# Altium schematic sheet Peripheral Interface.SchDoc
size A3; Date: 2026/04/16; ApprovedBy: NA; Author: 邱上峯; CompanyName: JFM常裕富士機工; Engineer: 邱上峯; Revision: V1.0; SheetNumber: 3; SheetTotal: 8; Pcb Name: NA
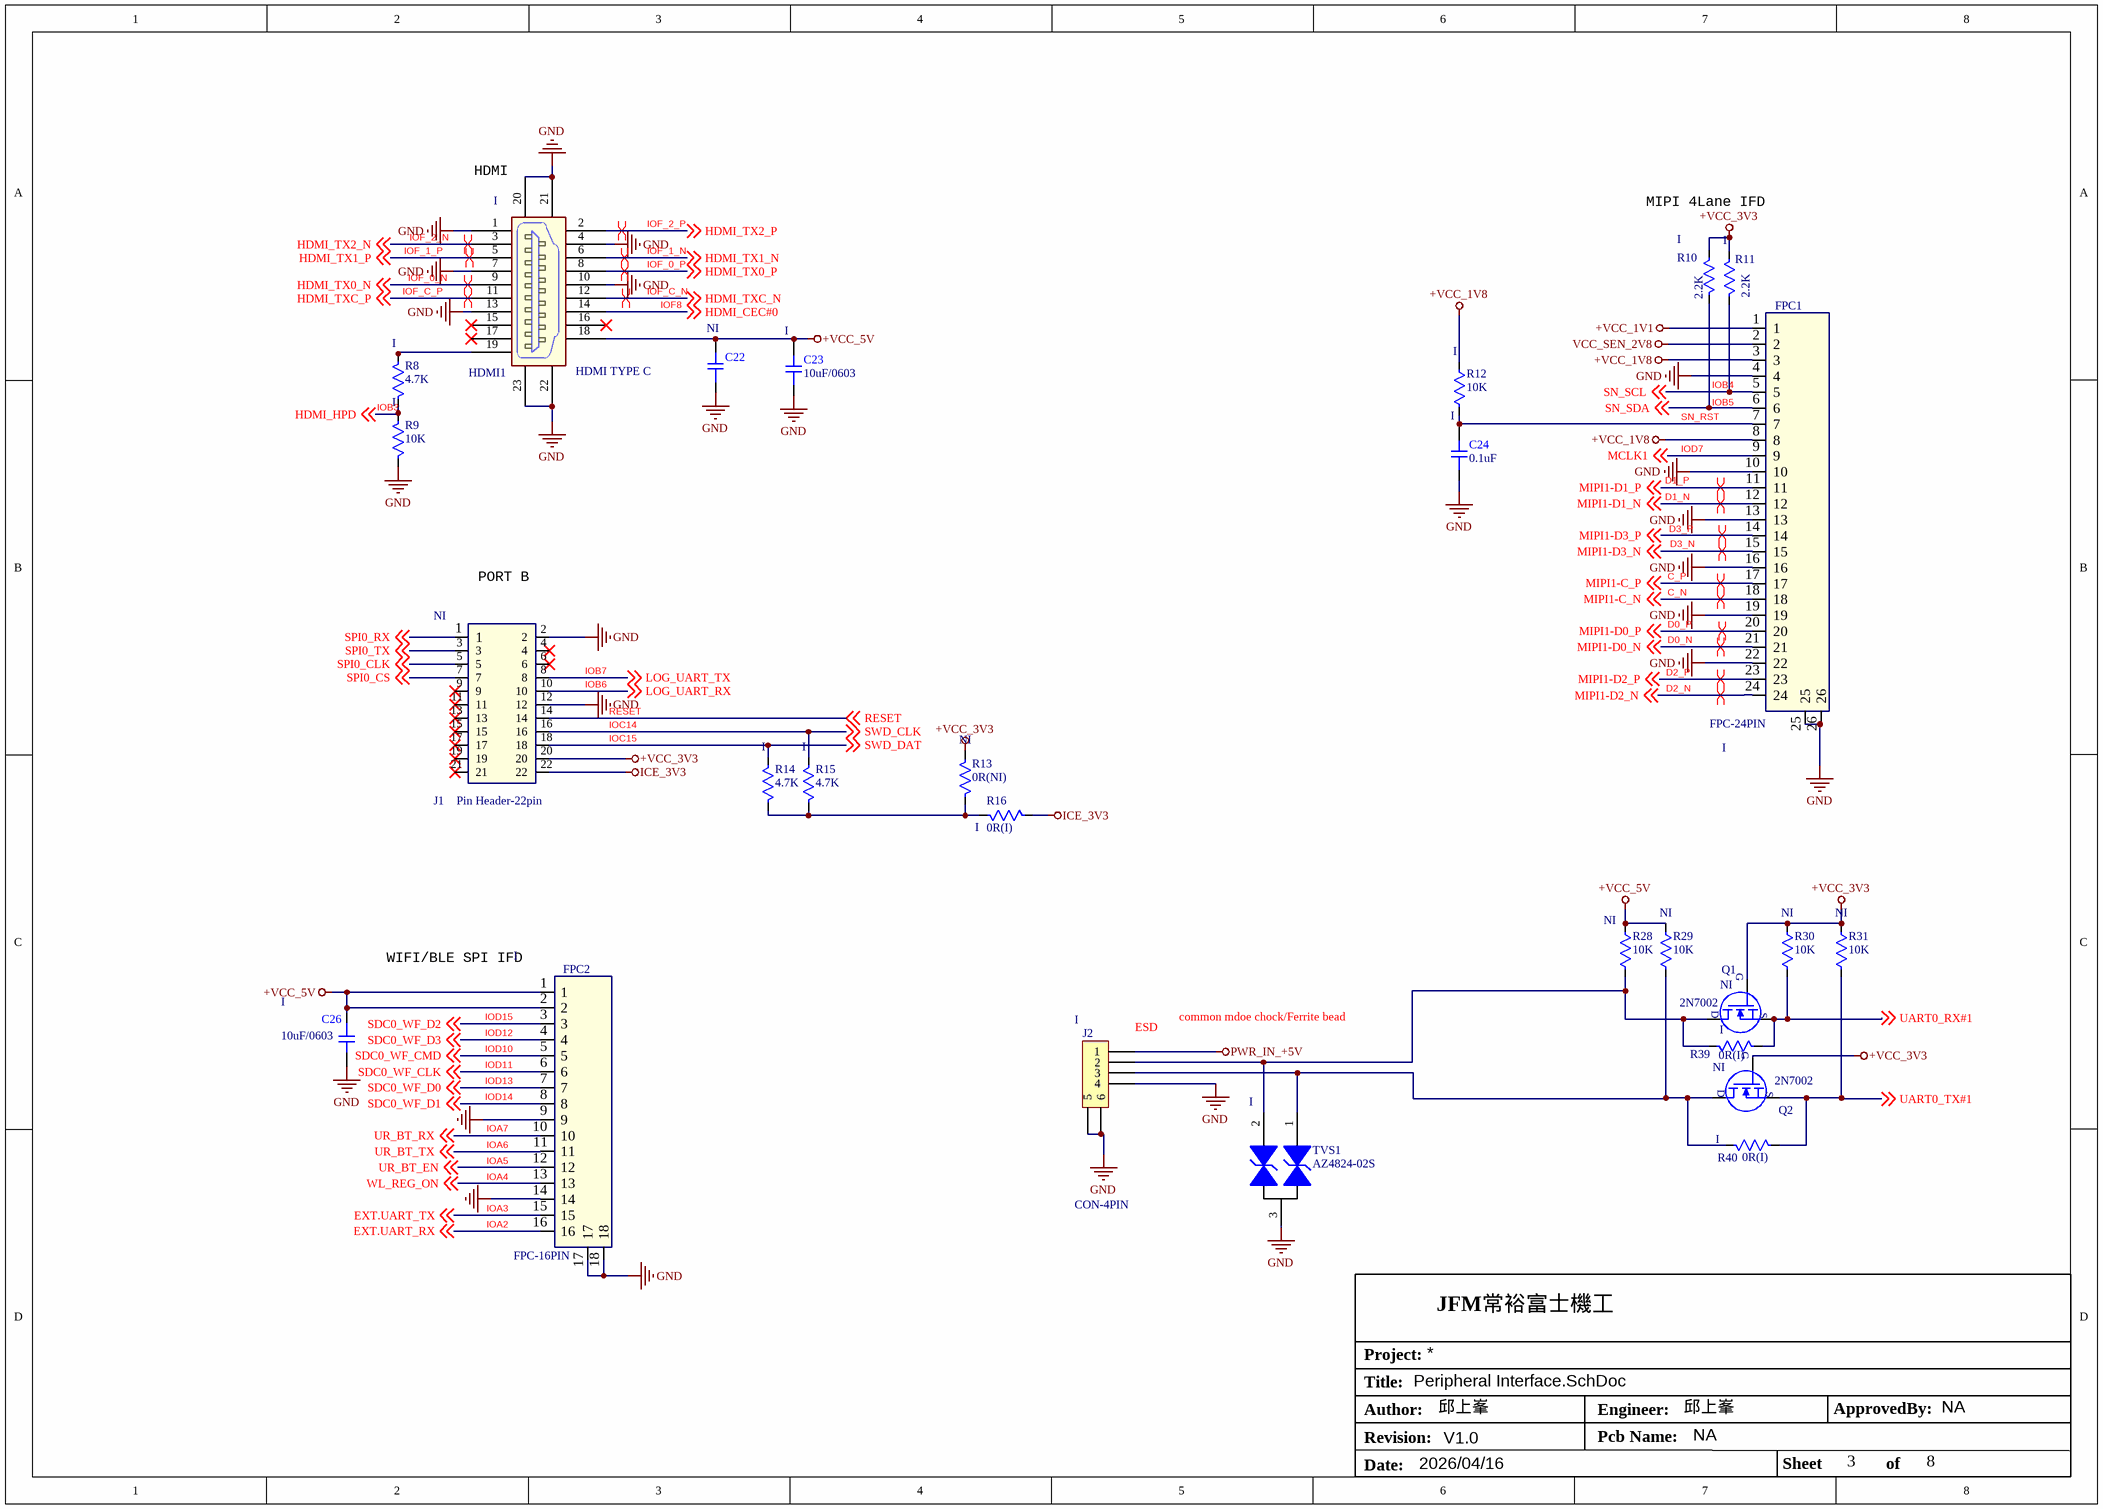
[diagram p0: Peripheral Interface.SchDoc]

## Parts
C22  NI  [C0402]
C23  10uF/0603  BOM: I  [C0603]
C24  0.1uF  BOM: I  [C0402]
C26  10uF/0603  BOM: I  [C0603]
FPC1  FPC-24PIN  BOM: I  [FPC-0.5 pitch 24PIN]
FPC2  FPC-16PIN  BOM: I  [FPC-0.5 pitch 16PIN]
HDMI1  HDMI TYPE C  BOM: I  [HDMI TYPE C]
J1  Pin Header-22pin  BOM: NI  [1.27mm Pin Header Through Hole-22P]
J2  CON-4PIN  BOM: I  [P20M2I-04SMT]
Q1  2N7002  BOM: NI  [SMD-SOT-23]
Q2  2N7002  BOM: NI  [SMD-SOT-23]
R8  4.7K  BOM: I  [R0402]
R9  10K  BOM: I  [R0402]
R10  2.2K  BOM: I  [R0603]
R11  2.2K  BOM: I  [R0603]
R12  10K  BOM: I  [R0402]
R13  0R(NI)  BOM: NI  [R0402]
R14  4.7K  BOM: I  [R0402]
R15  4.7K  BOM: I  [R0402]
R16  0R(I)  BOM: I  [R0402]
R28  10K  BOM: NI  [R0402]
R29  10K  BOM: NI  [R0402]
R30  10K  BOM: NI  [R0402]
R31  10K  BOM: NI  [R0402]
R39  0R(I)  BOM: I  [R0402]
R40  0R(I)  BOM: I  [R0402]
TVS1  AZ4824-02S  BOM: I  [SOT-23-3L]

## Nets
+VCC_1V1: FPC1.1
+VCC_1V8: FPC1.3 FPC1.8 R12.2
+VCC_3V3: J1.20 Q1.1(G) Q2.1(G) R10.2 R11.2 R13.1 R30.1 R31.1
+VCC_5V: C22.2 C23.2 C26.1 FPC2.1 FPC2.2 HDMI1.18 R28.1 R29.1
GND: C22.1 C23.1 C24.1 C26.2 FPC1.4 FPC1.10 FPC1.13 FPC1.16 FPC1.19 FPC1.22 FPC1.25 FPC1.26 FPC2.9 FPC2.14 FPC2.17 FPC2.18 HDMI1.1($PIN0) HDMI1.4 HDMI1.7 HDMI1.10 HDMI1.13 HDMI1.20 HDMI1.21 HDMI1.22 HDMI1.23 J1.2 J1.12 J2.4 J2.5 J2.6 R9.1 TVS1.3
ICE_3V3: J1.22 R16.2
PWR_IN_+5V: J2.1
VCC_SEN_2V8: FPC1.2
C_N: FPC1.18 ; off-sheet MIPI1-C_N  [also labelled MIPI1-C_N]
C_P: FPC1.17 ; off-sheet MIPI1-C_P  [also labelled MIPI1-C_P]
D0_N: FPC1.21 ; off-sheet MIPI1-D0_N  [also labelled MIPI1-D0_N]
D0_P: FPC1.20 ; off-sheet MIPI1-D0_P  [also labelled MIPI1-D0_P]
D1_N: FPC1.12 ; off-sheet MIPI1-D1_N  [also labelled MIPI1-D1_N]
D1_P: FPC1.11 ; off-sheet MIPI1-D1_P  [also labelled MIPI1-D1_P]
D2_N: FPC1.24 ; off-sheet MIPI1-D2_N  [also labelled MIPI1-D2_N]
D2_P: FPC1.23 ; off-sheet MIPI1-D2_P  [also labelled MIPI1-D2_P]
D3_N: FPC1.15 ; off-sheet MIPI1-D3_N  [also labelled MIPI1-D3_N]
IOA2: FPC2.16 ; off-sheet EXT.UART_RX  [also labelled EXT.UART_RX]
IOA3: FPC2.15 ; off-sheet EXT.UART_TX  [also labelled EXT.UART_TX]
IOA5: FPC2.12 ; off-sheet UR_BT_EN  [also labelled UR_BT_EN]
IOA6: FPC2.11 ; off-sheet UR_BT_TX  [also labelled UR_BT_TX]
IOA7: FPC2.10 ; off-sheet UR_BT_RX  [also labelled UR_BT_RX]
IOB3: R8.1 R9.2 ; off-sheet HDMI_HPD  [also labelled HDMI_HPD]
IOB4: FPC1.5 R11.1 ; off-sheet SN_SCL  [also labelled SN_SCL]
IOB6: J1.10 ; off-sheet LOG_UART_RX  [also labelled LOG_UART_RX]
IOB7: J1.8 ; off-sheet LOG_UART_TX  [also labelled LOG_UART_TX]
IOC14: J1.16 R15.2 ; off-sheet SWD_CLK  [also labelled SWD_CLK]
IOC15: J1.18 R14.2 ; off-sheet SWD_DAT  [also labelled SWD_DAT]
IOD7: FPC1.9 ; off-sheet MCLK1  [also labelled MCLK1]
IOD10: FPC2.5 ; off-sheet SDC0_WF_CMD  [also labelled SDC0_WF_CMD]
IOD11: FPC2.6 ; off-sheet SDC0_WF_CLK  [also labelled SDC0_WF_CLK]
IOD12: FPC2.4 ; off-sheet SDC0_WF_D3  [also labelled SDC0_WF_D3]
IOD13: FPC2.7 ; off-sheet SDC0_WF_D0  [also labelled SDC0_WF_D0]
IOD14: FPC2.8 ; off-sheet SDC0_WF_D1  [also labelled SDC0_WF_D1]
IOD15: FPC2.3 ; off-sheet SDC0_WF_D2  [also labelled SDC0_WF_D2]
IOF8: HDMI1.14 ; off-sheet HDMI_CEC#0  [also labelled HDMI_CEC#0]
IOF_0_N: HDMI1.9 ; off-sheet HDMI_TX0_N  [also labelled HDMI_TX0_N]
IOF_0_P: HDMI1.8 ; off-sheet HDMI_TX0_P  [also labelled HDMI_TX0_P]
IOF_1_N: HDMI1.6 ; off-sheet HDMI_TX1_N  [also labelled HDMI_TX1_N]
IOF_1_P: HDMI1.5 ; off-sheet HDMI_TX1_P  [also labelled HDMI_TX1_P]
IOF_2_N: HDMI1.3 ; off-sheet HDMI_TX2_N  [also labelled HDMI_TX2_N]
IOF_2_P: HDMI1.2 ; off-sheet HDMI_TX2_P  [also labelled HDMI_TX2_P]
IOF_C_N: HDMI1.12 ; off-sheet HDMI_TXC_N  [also labelled HDMI_TXC_N]
IOF_C_P: HDMI1.11 ; off-sheet HDMI_TXC_P  [also labelled HDMI_TXC_P]
MIPI1-D3_P: FPC1.14 ; off-sheet MIPI1-D3_P
RESET: J1.14 ; off-sheet RESET
SN_RST: C24.2 FPC1.7 R12.1
SN_SDA: FPC1.6 R10.1 ; off-sheet SN_SDA
SPI0_CLK: J1.5 ; off-sheet SPI0_CLK
SPI0_CS: J1.7 ; off-sheet SPI0_CS
SPI0_RX: J1.1 ; off-sheet SPI0_RX
SPI0_TX: J1.3 ; off-sheet SPI0_TX
UART0_RX#1: Q1.2(S) R30.2 R39.1 ; off-sheet UART0_RX#1
UART0_TX#1: Q2.2(S) R31.2 R40.1 ; off-sheet UART0_TX#1
WL_REG_ON: FPC2.13 ; off-sheet WL_REG_ON
NetHDMI1_19: HDMI1.19 R8.2
NetJ2_2: J2.2 Q1.3(D) R28.2 R39.2 TVS1.2(K)
NetJ2_3: J2.3 Q2.3(D) R29.2 R40.2 TVS1.1(A)
NetR13_2: R13.2 R14.1 R15.1 R16.1

Not connected (* = marked no-connect by the designer): HDMI1 15* 16* 17*; J1 4* 6* 9* 11* 13* 15* 17* 19* 21*

## Layout directives
differential pair: (no net found under the mark), C_N, C_P, D0_N, D0_P, D1_N, D1_P, D2_N, D2_P, D3_N, IOF_0_N, IOF_0_P, IOF_1_N, IOF_1_P, IOF_2_N, IOF_C_N, IOF_C_P

## Notes on the sheet
- (near HDMI1) HDMI
- MIPI 4Lane IFD
- (near J1) PORT B
- WIFI/BLE SPI IFD
- (near J2) ESD
- common mdoe chock/Ferrite bead
- Labels drawn without touching a wire or pin: D3_P, IOA4, IOB5
- Title:
- Project:
- Date:
- Author:
- Revision:
- Engineer:
- Pcb Name:
- Sheet
- ApprovedBy:
- of

## Library data of the parts
C22 = Cap: 0.1uF/0603; BOM: NI
C23 C24 C26 = Cap
FPC1 = FPC-24PIN: MIPI FPC-24PIN
FPC2 = FPC-16PIN: WIFI/BLE  FPC-16PIN
HDMI1 = HDMI TYPE D/C
J1 = 1.27mm Pin Header Through Hole22P: 1.27mm Pin Header Through Hole-22P
Q1 Q2 = NMOS-2N7002: MOSFET N-CHANNEL 60V 115mA
R8-R12 R14 R15 R28-R31 R39 R40 = Res
R13 R16 = Res: 0R
TVS1 = TVS_AZ4824-02S